# Altium project 聯合作品PCB.PrjPcb
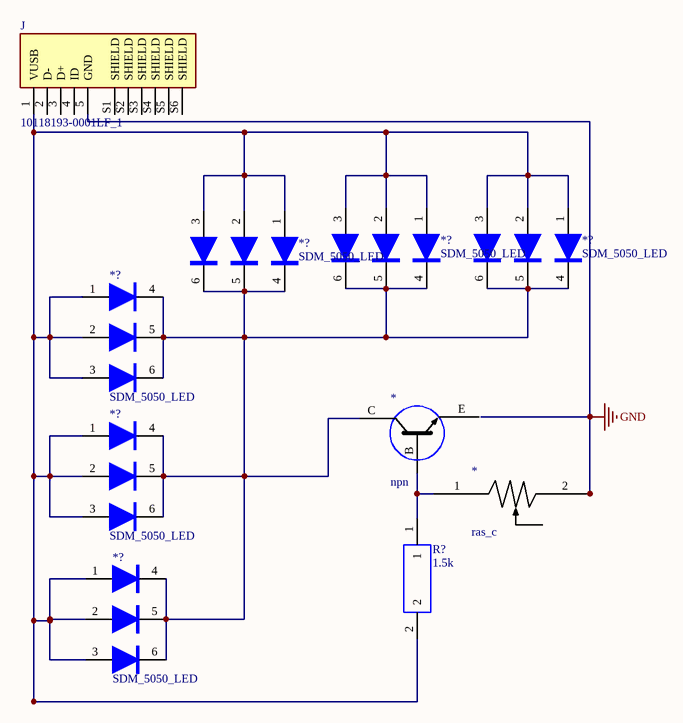
[diagram p0: Sheet3.SchDoc]
1 sheet, 10 parts. Net scope: global (net labels, ports and power ports of the same name join across sheets).
Board file: PCB2.PcbDoc

## Sheet Sheet3.SchDoc
size A4

### Parts
(Parts that share a designator on the sheet are numbered #1, #2 ... from top to bottom, then left to right.)
*#1  npn  [BC337]
*#2  ras_c  [VR1K]
*?#1  SDM_5050_LED  [SDM LED5050]
*?#2  SDM_5050_LED  [SDM LED5050]
*?#3  SDM_5050_LED  [SDM LED5050]
*?#4  SDM_5050_LED  [SDM LED5050]
*?#5  SDM_5050_LED  [SDM LED5050]
*?#6  SDM_5050_LED  [SDM LED5050]
J  10118193-0001LF_1  [FCI_10118193-0001LF]
R?  1.5k  [SDM1206]

### Nets
Net*#1_B: *#1.B *#2.1 R?.1
Net*#2_2: *#2.2 J.5(GND)
Net*?#1_1: *?#1.1 *?#1.2 *?#1.3 *?#2.1 *?#2.2 *?#2.3 *?#3.1 *?#3.2 *?#3.3 *?#4.1 *?#4.2 *?#4.3 *?#5.1 *?#5.2 *?#5.3 *?#6.1 *?#6.2 *?#6.3 J.1(VUSB) R?.2
Net*?#1_4: *?#1.4 *?#1.5 *?#1.6 *?#2.4 *?#2.5 *?#2.6 *?#3.4 *?#3.5 *?#3.6 *?#4.4 *?#4.5 *?#4.6 *?#5.4 *?#5.5 *?#5.6 *?#6.4 *?#6.5 *?#6.6

Not connected (* = marked no-connect by the designer): *#1 C E; J 2(D-) 3(D+) 4(ID) S1(SHIELD) S2(SHIELD) S3(SHIELD) S4(SHIELD) S5(SHIELD) S6(SHIELD)

### Notes on the sheet
- Labels drawn without touching a wire or pin: GND

### Library data of the parts
J = 10118193-0001LF_1: USB - micro B USB 2.0 Receptacle Connector 5 Position Surface Mount, Right Angle; Through Hole; MF: Amphenol ICC; Availability: Unavailable; SnapEDA_Link: https://www.snapeda.com/parts/10118193-0001LF/Amphenol%20FCI/view-part/2758989/?ref=snap; MP: 10118193-0001LF; Price: None; Value: *; Package: None
R? = res